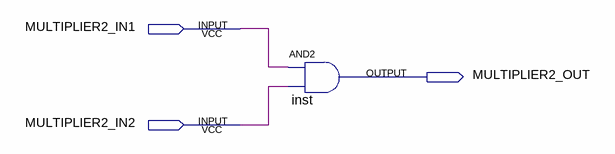
[diagram p0: schematic sheet]
// Quartus schematic MULTIPLIER2.bdf as structural Verilog: 1 symbols, 3 pins
module MULTIPLIER2 (
  input  MULTIPLIER2_IN1,
  input  MULTIPLIER2_IN2,
  output MULTIPLIER2_OUT
);

  and inst (MULTIPLIER2_OUT, MULTIPLIER2_IN1, MULTIPLIER2_IN2);
endmodule
